# Altium schematic sheet breakout.SchDoc: Pin Breakout
size A4; SheetNumber: 7; SheetTotal: 7
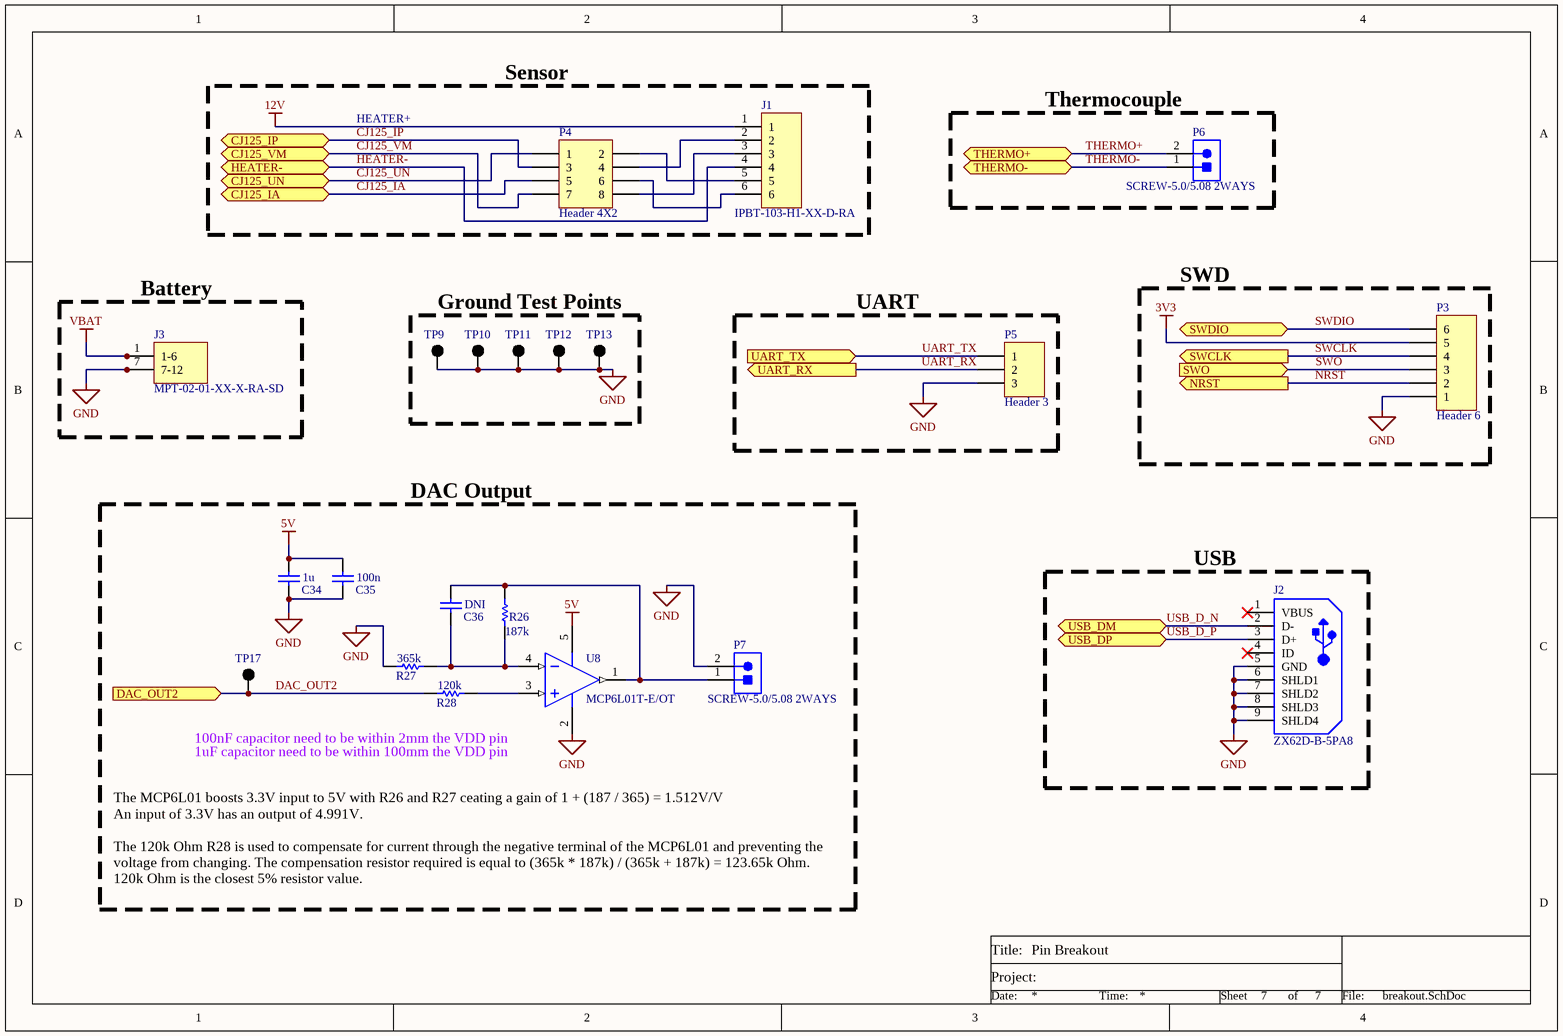
[diagram p0: breakout.SchDoc]

## Parts
C34  value 1u  [1206]  (hidden comment: Generic 1206 Capacitor)
C35  value 100n  [0805]  (hidden comment: Generic 0805 Capacitor)
C36  value DNI  [0805]  (hidden comment: Generic 0805 Capacitor)
J1  IPBT-103-H1-XX-D-RA  [IPBT-103-H1-XX-D-RA]
J2  ZX62D-B-5PA8  [HIRO-ZX62D-B-5PA8_V]
J3  MPT-02-01-XX-X-RA-SD  [MPT-02-01-XX-X-RA-SD]
P3  Header 6  [HDR1X6]
P4  Header 4X2  [HDR2X4]
P5  Header 3  [HDR1X3]
P6  SCREW-5.0/5.08 2WAYS  [Degson_DG126-5.0-02P-14]
P7  SCREW-5.0/5.08 2WAYS  [Degson_DG126-5.0-02P-14]
R26  value 187k  [0603]  (hidden comment: Generic 0603 Resistor)
R27  value 365k  [0603]  (hidden comment: Generic 0603 Resistor)
R28  value 120k  [0603]  (hidden comment: Generic 0603 Resistor)
TP9  5001  [KSTN-5001]  (value not drawn)
TP10  5001  [KSTN-5001]  (value not drawn)
TP11  5001  [KSTN-5001]  (value not drawn)
TP12  5001  [KSTN-5001]  (value not drawn)
TP13  5001  [KSTN-5001]  (value not drawn)
TP17  5001  [KSTN-5001]  (value not drawn)
U8  MCP6L01T-E/OT  [DDC0005A_M]

## Blocks framed on the sheet
Sensor: J1 P4
Thermocouple: P6
Battery: J3
SWD: P3
Ground Test Points: TP9-TP13
UART: P5
DAC Output: C34-C36 P7 R26-R28 TP17 U8
USB: J2

## Ports
CJ125_IA (bidir), CJ125_IP (bidir), CJ125_UN (bidir), CJ125_VM (bidir), DAC_OUT2 (in), HEATER- (bidir), NRST (out), SWCLK (out), SWDIO (bidir), SWO (in), THERMO+ (bidir), THERMO- (bidir), UART_RX (out), UART_TX (in), USB_DM (bidir), USB_DP (bidir)

## Nets
3V3: P3.5
5V: C34.2 C35.2 U8.5(VDD)
12V: J1.1
GND: C34.1 C35.1 J2.5(GND) J2.6(SHLD1) J2.7(SHLD2) J2.8(SHLD3) J2.9(SHLD4) J3.7(7-12) J3.8 J3.9 J3.10 J3.11 J3.12 P3.1 P5.3 P7.2 R27.1 TP9.1 TP10.1 TP11.1 TP12.1 TP13.1 U8.2(VSS)
VBAT: J3.1(1-6) J3.2 J3.3 J3.4 J3.5 J3.6
CJ125_IA: P4.5 ; port CJ125_IA
CJ125_IP: P4.3 ; port CJ125_IP
CJ125_UN: P4.1 ; port CJ125_UN
CJ125_VM: P4.7 ; port CJ125_VM
DAC_OUT2: R28.1 TP17.1 ; port DAC_OUT2
HEATER-: J1.4 ; port HEATER-
NRST: P3.2 ; port NRST
SWCLK: P3.4 ; port SWCLK
SWDIO: P3.6 ; port SWDIO
SWO: P3.3 ; port SWO
THERMO+: P6.2 ; port THERMO+
THERMO-: P6.1 ; port THERMO-
UART_RX: P5.2 ; port UART_RX
UART_TX: P5.1 ; port UART_TX
USB_D_N: J2.2(D-) ; port USB_DM
USB_D_P: J2.3(D+) ; port USB_DP
NetC36_1: C36.1 R26.1 R27.2 U8.4(VIN-)
NetC36_2: C36.2 P7.1 R26.2 U8.1(VOUT)
NetJ1_2: J1.2 P4.4
NetJ1_3: J1.3 P4.8
NetJ1_5: J1.5 P4.2
NetJ1_6: J1.6 P4.6
NetR28_2: R28.2 U8.3(VIN+)

Not connected (* = marked no-connect by the designer): J2 1(VBUS)* 4(ID)*

## Notes on the sheet
- HEATER+
- 100nF capacitor need to be within 2mm the VDD pin
- 1uF capacitor need to be within 100mm the VDD pin
- The MCP6L01 boosts 3.3V input to 5V with R26 and R27 ceating a gain of 1 + (187 / 365) = 1.512V/V
  An input of 3.3V has an output of 4.991V.
  The 120k Ohm R28 is used to compensate for current through the negative terminal of the MCP6L01 and preventing the voltage from changing. The compensation resistor required is equal to (365k * 187k) / (365k + 187k) = 123.65k Ohm. 120k Ohm is the closest 5% resistor value.
- Title
- Title:
- Project:
- Size:
- Date:
- File:
- E
- Number:
- Time:
- Revision:
- Sheet
- of

## Library data of the parts
C34 = C_1206: Specifications: *
C35 C36 = C_0805: Specifications: *
J1 = IPBT-103-H1-XX-D-RA: 0.165 INCH DOUBLE ROW TERMINAL ASSEMBLY; ComponentLink1Description: Manufacturer URL; ComponentLink3Description: Package Specification; ComponentLink2URL: http://cds.linear.com/docs/en/datasheet/4356fa.pdf; ComponentLink3URL: http://cds.linear.com/docs/en/packaging/05081661_F_MS.pdf; ComponentLink1URL: http://www.linear.com/; ComponentLink2Description: Datasheet
J2 = Micro_USB: Micro-USB Connector Meeting USB 2.0 Standard, -30 to 85 degC, 5-Pin SMD, RoHS, Tape and Reel; Manufacturer: HiroseElectric; Number of Contacts: 5Contact; Current Rating: 1A; Brand: HiroseConnector; Number of Ports: 1Port; Voltage Rating: 30V; Mounting Angle: Right; Gender: Male; Connector Type: Receptacle; RoHS: Details; Package Reference: ZX62D-B-5PA8; Contact Plating: Gold; Product: MicroUSBTypeBConnectors; Shell Plating: Tin; Datasheet Version: 08/2010; Factory Pack Quantity: 2000; Manufacturer URL: https://www.hirose.com; Standard: USB2.0; Datasheet URL: https://datasheet.ciiva.com/22825/0900766b8118f7b1-22825836.pdf; Package Description: 5-Pin Surface Mount Device, Body 7.5 x 5 mm, Pitch 0.65 mm; Operating Temperature Range: -30Cto+85C; Series: ZX; Contact Material: CopperAlloy; Color: Black; Mounting Technology: SurfaceMount; Product Category: USBConnectors; Termination Style: Solder; Packaging: Reel
P3 = Header 6: Header, 6-Pin; LatestRevisionDate: 17-Jul-2002; LatestRevisionNote: Re-released for DXP Platform.; Publisher: Altium Limited
P4 = Header 4X2: Header, 4-Pin, Dual row; LatestRevisionDate: 17-Jul-2002; LatestRevisionNote: Re-released for DXP Platform.; Publisher: Altium Limited
P5 = Header 3: Header, 3-Pin; LatestRevisionDate: 17-Jul-2002; LatestRevisionNote: Re-released for DXP Platform.; Publisher: Altium Limited
P6 P7 = Screw_Header_2: Socket, Screw Terminal Block, 2 Way, 5.0 mm Pitch, 90 Degree Angle, Through-Hole; Manufacturer: No Vendor; Insulation Resistance: 5000 MOhm / 1000 V; Contact Resistance: 20 mOhm; Rated Current: 25 A; Poles: 2; Rated Voltage: 300 V; PartNumber: SCREW-5.0/5.08 2WAYS; ComponentLink1Description: Datasheet; ComponentLink1URL: 5mm screw terminal in SVN; Mounting Technology: Through Hole; PackageDescription: Socket, Screw Terminal Block, 2 Way, Pitch 5 mm, 90 Degree Angle, Through-Hole; Temperature Range: -40 to 105 degC
R26-R28 = R_0603: Specifications: *
TP9-TP13 TP17 = TP5001: Test Point, Black, 1-Pin THD, RoHS, Bulk; Manufacturer: Keystone; Other Names: 5001K; Catalog Drawings: 5000Series; Alternate Color: 5004K-ND / -TESTPOINTPCMINI.040"DYELLOW / 5003K-ND / -TESTPOINTPCMINI.040"DORANGE / 5002K-ND / -TESTPOINTPCMINI.040"DWHITE / 5000K-ND / -TESTPOINTPCMINI.040"DRED; Kits: DKTGRS232C-KIT-ND / -TTLCONVERTER; Online Catalog: ColorCodedTestPoints; Datasheet URL: https://ciiva.com/datasheet-click-2917627?src=ciiva&sig=bd195616; Mounting Type: 0.040"(1.02mm)HoleDiameter; Family: TestPoints; RoHS Information: RoHSComplianceStatement; Datasheet Version: Rev. G, 12/2008; Color: Black; Category: TestandMeasurement; Standard Package: 100; Manufacturer URL: http://www.keyelco.com/; Material: Base,Nylon46,UL94V-0; Type: PCTestPoint,Miniature; Terminal: 0.010"x0.020"(0.25mmx0.51mm)PhosphorBronzeWire,SilverPlated; Series: THM; Packaging: Bulk
U8 = MCP6L01: 1 MHz, 85 uA Op Amp, 5-Pin SOT-23, Extended Temperature Range; Code_IPC: SOT23-5; ComponentLink3Description: Package Specification; PackageVersion: revBB, Aug-2009; ComponentLink3URL: http://www.microchip.com/stellent/groups/techpub_sg/documents/packagingspec/en012702.pdf; ComponentLink1Description: Manufacturer URL; DatasheetVersion: revB, Sep-2011; PackageDescription: 5-Lead Plastic Small Outline Transistor (OT) [SOT-23]; PackageReference: SOT-23-OT5; ComponentLink1URL: http://www.microchip.com/; ComponentLink2Description: Datasheet; ComponentLink2URL: http://ww1.microchip.com/downloads/en/DeviceDoc/22140b.pdf; RevisionNote: URLs added. DatasheetVersion updated.
J3 = MPT-02-01-XX-X-RA-SD: ComponentLink1Description: Manufacturer URL; ComponentLink3Description: Package Specification; ComponentLink2URL: http://cds.linear.com/docs/en/datasheet/4356fa.pdf; ComponentLink3URL: http://cds.linear.com/docs/en/packaging/05081661_F_MS.pdf; ComponentLink1URL: http://www.linear.com/; ComponentLink2Description: Datasheet